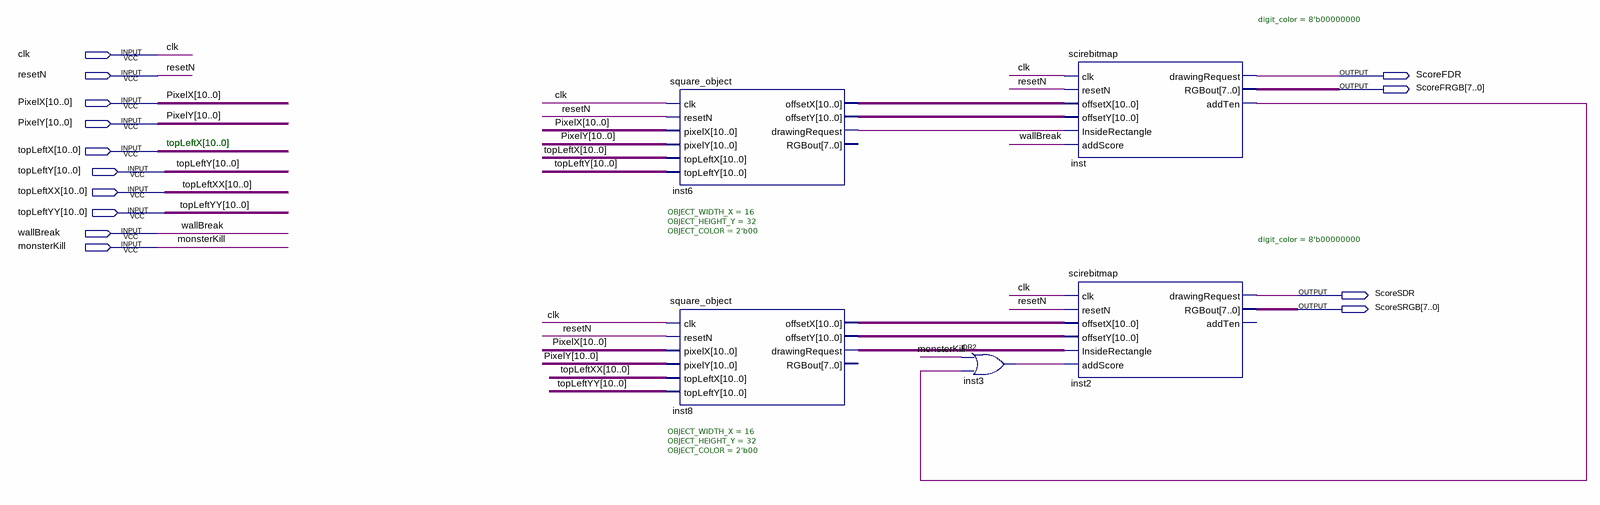
[diagram p0: schematic sheet]
// Quartus schematic scoreCounter.bdf as structural Verilog: 5 symbols, 14 pins
module scoreCounter (
  input  clk,
  input  resetN,
  input  [10:0] PixelX,
  input  [10:0] PixelY,
  input  [10:0] topLeftX,
  input  [10:0] topLeftY,
  input  [10:0] topLeftXX,
  input  [10:0] topLeftYY,
  input  wallBreak,
  input  monsterKill,
  output ScoreFDR,
  output [7:0] ScoreFRGB,
  output ScoreSDR,
  output [7:0] ScoreSRGB
);

  wire inst3_out, inst6_drawingrequest, inst8_drawingrequest, inst_addten;
  wire [10:0] inst6_offsetx, inst6_offsety, inst8_offsetx, inst8_offsety;

  square_object #(.OBJECT_WIDTH_X(16), .OBJECT_HEIGHT_Y(32), .OBJECT_COLOR(2'b00)) inst6 (
    .clk(clk), .resetN(resetN), .pixelX(PixelX), .pixelY(PixelY), .topLeftX(topLeftX), .topLeftY(topLeftY),
    .offsetX(inst6_offsetx), .offsetY(inst6_offsety), .drawingRequest(inst6_drawingrequest));  // open: RGBout
  square_object #(.OBJECT_WIDTH_X(16), .OBJECT_HEIGHT_Y(32), .OBJECT_COLOR(2'b00)) inst8 (
    .clk(clk), .resetN(resetN), .pixelX(PixelX), .pixelY(PixelY), .topLeftX(topLeftXX), .topLeftY(topLeftYY),
    .offsetX(inst8_offsetx), .offsetY(inst8_offsety), .drawingRequest(inst8_drawingrequest));  // open: RGBout
  or inst3 (inst3_out, monsterKill, inst_addten);
  scirebitmap #(.digit_color(8'b00000000)) inst (
    .clk(clk), .resetN(resetN), .offsetX(inst6_offsetx), .offsetY(inst6_offsety),
    .InsideRectangle(inst6_drawingrequest), .addScore(wallBreak), .drawingRequest(ScoreFDR),
    .RGBout(ScoreFRGB), .addTen(inst_addten));
  scirebitmap #(.digit_color(8'b00000000)) inst2 (
    .clk(clk), .resetN(resetN), .offsetX(inst8_offsetx), .offsetY(inst8_offsety),
    .InsideRectangle(inst8_drawingrequest), .addScore(inst3_out), .drawingRequest(ScoreSDR),
    .RGBout(ScoreSRGB));  // open: addTen

  // Notes on the sheet:
  //   topLeftX[10..0]
endmodule
